# EasyEDA schematic SCH_FIT_MIX_2024-07-01.json
TITLE: FIT MIX; REV: 1.0; Date: 2024-06-26; Sheet: 1/1; Drawn By: Group 31; Company: University Of Moratuwa
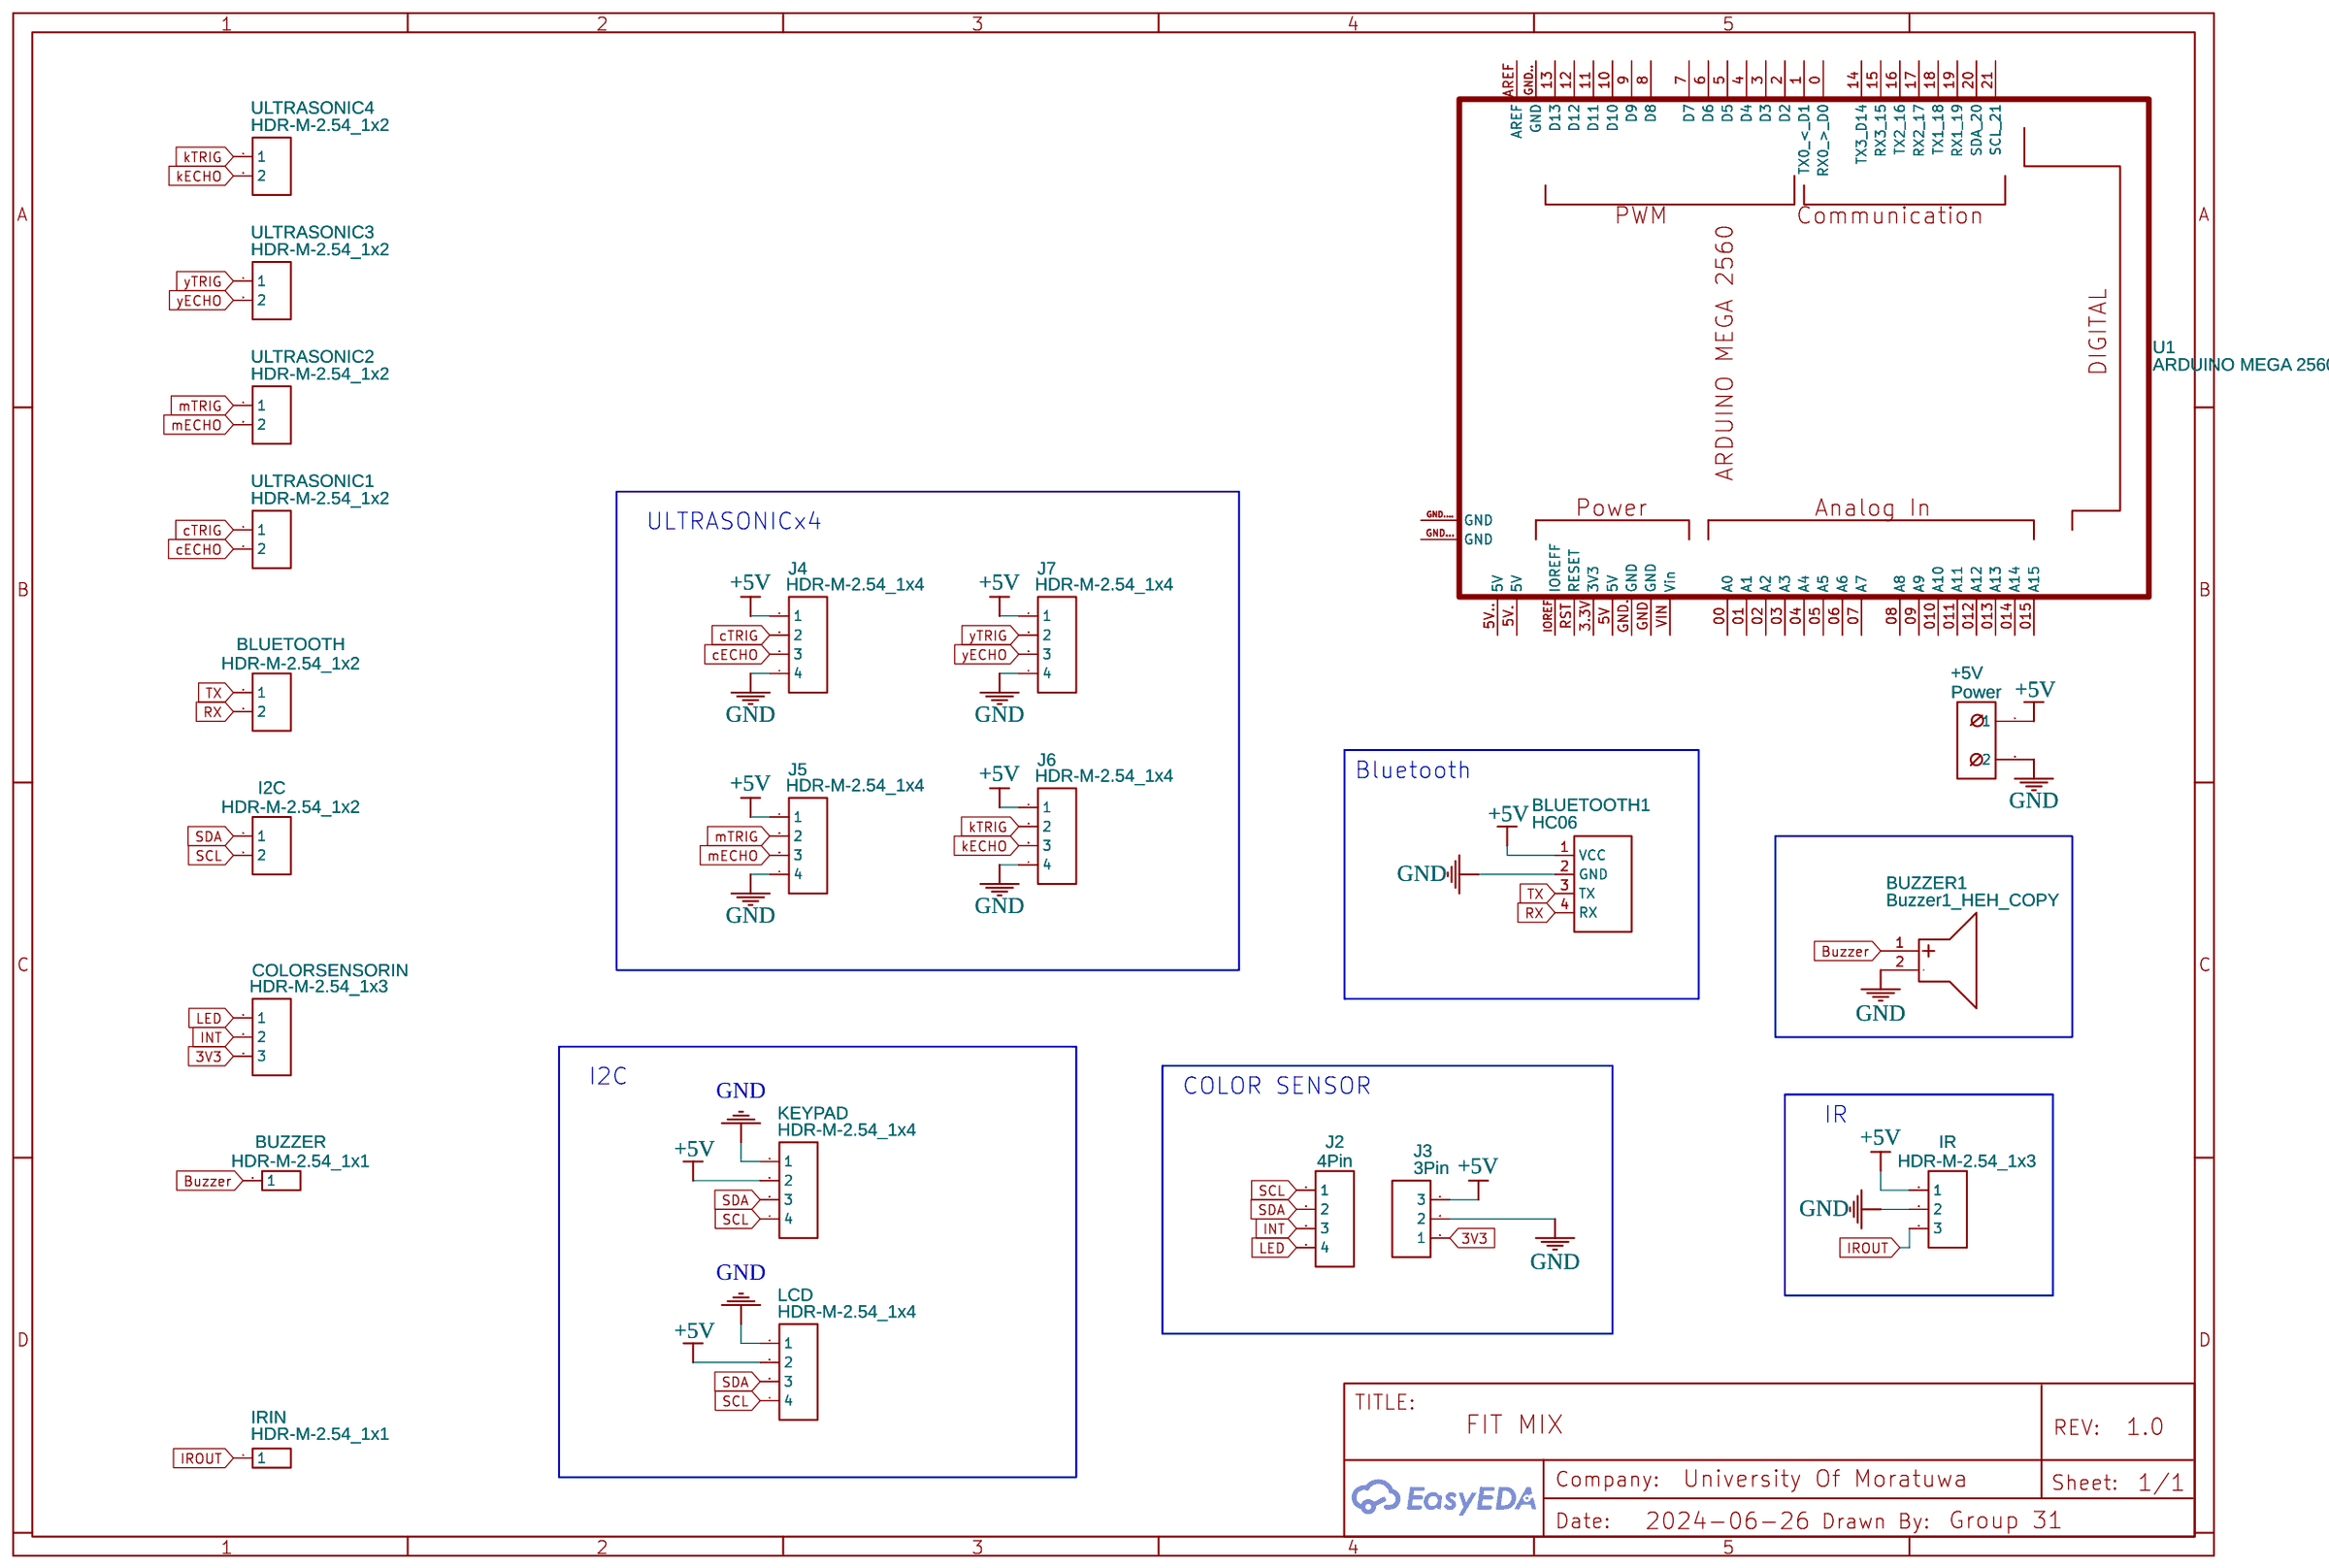
[diagram p0: schematic sheet]

## Parts
+5V  Power  [5MM_2POS_TERMINAL_BLOCK_TPD]
BLUETOOTH  HDR-M-2.54_1x2  [HDR-M-2.54_1X2]
BLUETOOTH1  HC06  [HC06]
BUZZER  HDR-M-2.54_1x1  [HDR-M-2.54_1X1]
BUZZER1  Buzzer1_HEH_COPY  [BUZZER]
COLORSENSORIN  HDR-M-2.54_1x3  [HDR-M-2.54_1X3]
I2C  HDR-M-2.54_1x2  [HDR-M-2.54_1X2]
IR  HDR-M-2.54_1x3  [HDR-M-2.54_1X3]
IRIN  HDR-M-2.54_1x1  [HDR-M-2.54_1X1]
J2  4Pin  [HDR-M-2.54_1X4]
J3  3Pin  [HDR-M-2.54_1X3]
J4  HDR-M-2.54_1x4  [HDR-M-2.54_1X4]
J5  HDR-M-2.54_1x4  [HDR-M-2.54_1X4]
J6  HDR-M-2.54_1x4  [HDR-M-2.54_1X4]
J7  HDR-M-2.54_1x4  [HDR-M-2.54_1X4]
KEYPAD  HDR-M-2.54_1x4  [HDR-M-2.54_1X4]
LCD  HDR-M-2.54_1x4  [HDR-M-2.54_1X4]
U1  ARDUINO MEGA 2560 R3 V1.0_shella  [TWIX_MEGA_PCB____ARDUINO-MEGA2560-FOOTPRINT_]
ULTRASONIC1  HDR-M-2.54_1x2  [HDR-M-2.54_1X2]
ULTRASONIC2  HDR-M-2.54_1x2  [HDR-M-2.54_1X2]
ULTRASONIC3  HDR-M-2.54_1x2  [HDR-M-2.54_1X2]
ULTRASONIC4  HDR-M-2.54_1x2  [HDR-M-2.54_1X2]

## Library data of the parts
+5V = 2POSITION_TERMINAL_BLOCK: Contributor: tpdecker
BLUETOOTH I2C ULTRASONIC1-ULTRASONIC4 = HDR-M-2.54_1x2: Supplier Part: C124375; Supplier: LCSC; Contributor: LCEDA_Lib
BLUETOOTH1 = HC06: Supplier: LCSC; Contributor: Zelevar
BUZZER IRIN = HDR-M-2.54_1x1: Supplier Part: C81276; Supplier: LCSC; Contributor: LCEDA_Lib
BUZZER1 = Buzzer1_HEH_COPY: Supplier: LCSC; Supplier Part: C194534; Manufacturer: ZLFY; Manufacturer Part: -5; Contributor: fabiomirasola
COLORSENSORIN IR J3 = HDR-M-2.54_1x3: Supplier Part: C180248; Supplier: LCSC; Contributor: LCEDA_Lib
J2 J4-J7 KEYPAD LCD = HDR-M-2.54_1x4: Supplier Part: C124378; Supplier: LCSC; Contributor: LCEDA_Lib
U1 = ARDUINO MEGA 2560 R3 V1.0: Contributor: pascachandra

## Nets
3V3: COLORSENSORIN.3 J3.1
+5V: +5V.1 BLUETOOTH1.1(VCC) IR.1 J3.3 J4.1 J5.1 J6.1 J7.1 KEYPAD.2 LCD.2
GND: +5V.2 BLUETOOTH1.2(GND) BUZZER1.2(-) IR.2 J3.2 J4.4 J5.4 J6.4 J7.4 KEYPAD.1 LCD.1
Buzzer: BUZZER.1 BUZZER1.1(+)
cECHO: J4.3 ULTRASONIC1.2
cTRIG: J4.2 ULTRASONIC1.1
INT: COLORSENSORIN.2 J2.3
IROUT: IR.3 IRIN.1
kECHO: J6.3 ULTRASONIC4.2
kTRIG: J6.2 ULTRASONIC4.1
LED: COLORSENSORIN.1 J2.4
mECHO: J5.3 ULTRASONIC2.2
mTRIG: J5.2 ULTRASONIC2.1
RX: BLUETOOTH.2 BLUETOOTH1.4(RX)
SCL: I2C.2 J2.1 KEYPAD.4 LCD.4
SDA: I2C.1 J2.2 KEYPAD.3 LCD.3
TX: BLUETOOTH.1 BLUETOOTH1.3(TX)
yECHO: J7.3 ULTRASONIC3.2
yTRIG: J7.2 ULTRASONIC3.1

Not connected (* = marked no-connect by the designer): U1 00(A0) 0(RX0 > D0) 01(A1) 1(TX0 < D1) 02(A2) 2(D2) 03(A3) 3(D3) 3.3V(3V3) 04(A4) 4(D4) 05(A5) 5(D5) 5V 5V.(5V) 5V..(5V) 06(A6) 6(D6) 07(A7) 7(D7) 08(A8) 8(D8) 09(A9) 9(D9) 010(A10) 10(D10) 011(A11) 11(D11) 012(A12) 12(D12) 013(A13) 13(D13) 014(A14) 14(TX3 D14) 015(A15) 15(RX3 15) 16(TX2 16) 17(RX2 17) 18(TX1 18) 19(RX1 19) 20(SDA 20) 21(SCL 21) AREF GND GND.(GND) GND..(GND) GND...(GND) GND....(GND) IOREF(IOREFF) RST(RESET) VIN(Vin)

## Notes on the sheet
- ULTRASONICx4
- Bluetooth
- I2C
- COLOR SENSOR
- IR
